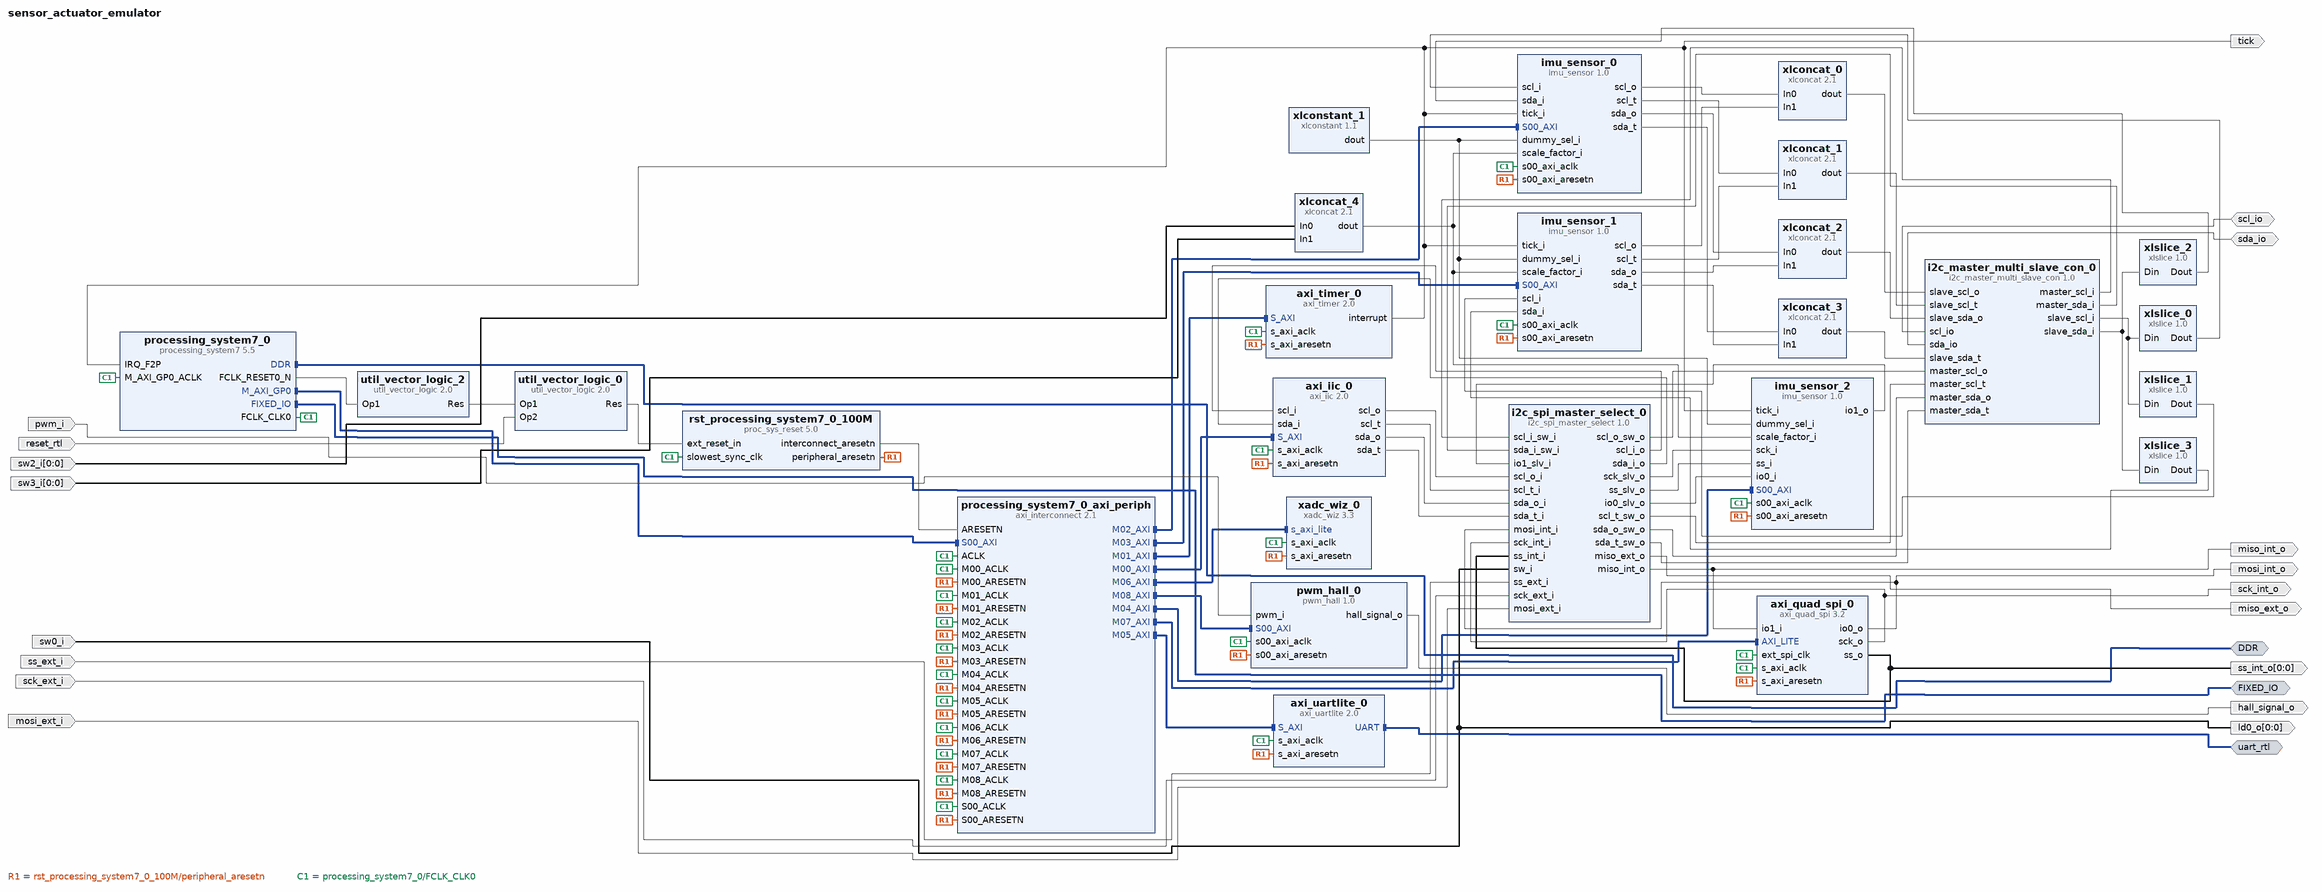
[diagram p0: block diagram of the top level]
# Vivado block design sensor_actuator_emulator, Vivado 2016.1
create_bd_design sensor_actuator_emulator

create_bd_intf_port -mode Master -vlnv xilinx.com:interface:uart_rtl:1.0 uart_rtl
create_bd_intf_port -mode Master -vlnv xilinx.com:interface:ddrx_rtl:1.0 DDR
create_bd_intf_port -mode Master -vlnv xilinx.com:display_processing_system7:fixedio_rtl:1.0 FIXED_IO
create_bd_port -dir IO scl_io
create_bd_port -dir IO sda_io
create_bd_port -dir O -type intr tick
create_bd_port -dir O hall_signal_o
create_bd_port -dir I pwm_i
create_bd_port -dir I -type rst reset_rtl
set_property -dict {CONFIG.POLARITY ACTIVE_HIGH} [get_bd_ports reset_rtl]
create_bd_port -dir O -from 0 -to 0 ld0_o
create_bd_port -dir I ss_ext_i
create_bd_port -dir I sck_ext_i
create_bd_port -dir I mosi_ext_i
create_bd_port -dir O miso_ext_o
create_bd_port -dir O miso_int_o
create_bd_port -dir O mosi_int_o
create_bd_port -dir O sck_int_o
create_bd_port -dir O -from 0 -to 0 ss_int_o
create_bd_port -dir I sw0_i
create_bd_port -dir I -from 0 -to 0 sw2_i
create_bd_port -dir I -from 0 -to 0 sw3_i

create_bd_cell -type ip -vlnv xilinx.com:ip:axi_iic:2.0 axi_iic_0
set_property -dict {CONFIG.IIC_FREQ_KHZ 400 CONFIG.USE_BOARD_FLOW true CONFIG.IIC_BOARD_INTERFACE Custom} [get_bd_cells axi_iic_0]
create_bd_cell -type ip -vlnv xilinx.com:ip:axi_uartlite:2.0 axi_uartlite_0
set_property -dict {CONFIG.C_BAUDRATE 115200} [get_bd_cells axi_uartlite_0]
create_bd_cell -type ip -vlnv xilinx.com:ip:xlconstant:1.1 xlconstant_1
set_property -dict {CONFIG.CONST_WIDTH 2} [get_bd_cells xlconstant_1]
create_bd_cell -type ip -vlnv user.org:user:i2c_master_multi_slave_con:1.0 i2c_master_multi_slave_con_0
set_property -dict {CONFIG.G_NUM_SLAVES 2} [get_bd_cells i2c_master_multi_slave_con_0]
create_bd_cell -type ip -vlnv xilinx.com:ip:xlconcat:2.1 xlconcat_0
set_property -dict {CONFIG.NUM_PORTS 2} [get_bd_cells xlconcat_0]
create_bd_cell -type ip -vlnv xilinx.com:ip:xlconcat:2.1 xlconcat_1
set_property -dict {CONFIG.NUM_PORTS 2} [get_bd_cells xlconcat_1]
create_bd_cell -type ip -vlnv xilinx.com:ip:xlconcat:2.1 xlconcat_2
set_property -dict {CONFIG.NUM_PORTS 2} [get_bd_cells xlconcat_2]
create_bd_cell -type ip -vlnv xilinx.com:ip:xlconcat:2.1 xlconcat_3
set_property -dict {CONFIG.NUM_PORTS 2} [get_bd_cells xlconcat_3]
create_bd_cell -type ip -vlnv xilinx.com:ip:xlslice:1.0 xlslice_0
set_property -dict {CONFIG.DIN_TO 0 CONFIG.DIN_FROM 0 CONFIG.DIN_WIDTH 2} [get_bd_cells xlslice_0]
create_bd_cell -type ip -vlnv xilinx.com:ip:xlslice:1.0 xlslice_1
set_property -dict {CONFIG.DOUT_WIDTH 1 CONFIG.DIN_TO 1 CONFIG.DIN_FROM 1 CONFIG.DIN_WIDTH 2} [get_bd_cells xlslice_1]
create_bd_cell -type ip -vlnv xilinx.com:ip:xlslice:1.0 xlslice_2
set_property -dict {CONFIG.DIN_TO 0 CONFIG.DIN_FROM 0 CONFIG.DIN_WIDTH 2} [get_bd_cells xlslice_2]
create_bd_cell -type ip -vlnv xilinx.com:ip:xlslice:1.0 xlslice_3
set_property -dict {CONFIG.DOUT_WIDTH 1 CONFIG.DIN_TO 1 CONFIG.DIN_FROM 1 CONFIG.DIN_WIDTH 2} [get_bd_cells xlslice_3]
create_bd_cell -type ip -vlnv xilinx.com:ip:xadc_wiz:3.3 xadc_wiz_0
set_property -dict [list \
  CONFIG.XADC_STARUP_SELECTION channel_sequencer \
  CONFIG.SEQUENCER_MODE Continuous \
  CONFIG.OT_ALARM false \
  CONFIG.USER_TEMP_ALARM false \
  CONFIG.VCCINT_ALARM false \
  CONFIG.VCCAUX_ALARM false \
  CONFIG.VCCINT_ALARM_LOWER 0.97 \
  CONFIG.VCCINT_ALARM_UPPER 1.03 \
  CONFIG.ENABLE_VCCPINT_ALARM false \
  CONFIG.ENABLE_VCCPAUX_ALARM false \
  CONFIG.ENABLE_VCCDDRO_ALARM false \
  CONFIG.SINGLE_CHANNEL_SELECTION VP_VN \
  CONFIG.ENABLE_EXTERNAL_MUX false \
  CONFIG.EXTERNAL_MUX_CHANNEL VP_VN \
  CONFIG.CHANNEL_ENABLE_TEMPERATURE true \
  CONFIG.CHANNEL_ENABLE_VCCINT true \
  CONFIG.CHANNEL_ENABLE_VP_VN false \
  CONFIG.ENABLE_TEMP_BUS false \
  CONFIG.ENABLE_AXI4STREAM false \
] [get_bd_cells xadc_wiz_0]
create_bd_cell -type ip -vlnv xilinx.com:ip:processing_system7:5.5 processing_system7_0
set_property -dict [list \
  CONFIG.PCW_UIPARAM_DDR_FREQ_MHZ 525 \
  CONFIG.PCW_CRYSTAL_PERIPHERAL_FREQMHZ 50.000000 \
  CONFIG.PCW_APU_PERIPHERAL_FREQMHZ 650 \
  CONFIG.PCW_SDIO_PERIPHERAL_FREQMHZ 50 \
  CONFIG.PCW_FPGA0_PERIPHERAL_FREQMHZ 100 \
  CONFIG.PCW_USE_FABRIC_INTERRUPT 1 \
  CONFIG.PCW_IRQ_F2P_INTR 1 \
  CONFIG.PCW_PRESET_BANK1_VOLTAGE {LVCMOS 1.8V} \
  CONFIG.PCW_UIPARAM_DDR_PARTNO {MT41K128M16 JT-125} \
  CONFIG.PCW_QSPI_PERIPHERAL_ENABLE 1 \
  CONFIG.PCW_QSPI_GRP_SINGLE_SS_ENABLE 1 \
  CONFIG.PCW_QSPI_GRP_FBCLK_ENABLE 1 \
  CONFIG.PCW_ENET0_PERIPHERAL_ENABLE 1 \
  CONFIG.PCW_ENET0_ENET0_IO {MIO 16 .. 27} \
  CONFIG.PCW_ENET0_GRP_MDIO_ENABLE 1 \
  CONFIG.PCW_ENET0_RESET_ENABLE 0 \
  CONFIG.PCW_SD0_PERIPHERAL_ENABLE 1 \
  CONFIG.PCW_SD0_GRP_CD_ENABLE 1 \
  CONFIG.PCW_SD0_GRP_CD_IO {MIO 47} \
  CONFIG.PCW_SD0_GRP_WP_ENABLE 1 \
  CONFIG.PCW_UART1_PERIPHERAL_ENABLE 1 \
  CONFIG.PCW_TTC0_PERIPHERAL_ENABLE 1 \
  CONFIG.PCW_USB0_PERIPHERAL_ENABLE 1 \
  CONFIG.PCW_USB0_RESET_ENABLE 1 \
  CONFIG.PCW_USB0_RESET_IO {MIO 46} \
  CONFIG.PCW_GPIO_MIO_GPIO_ENABLE 1 \
] [get_bd_cells processing_system7_0]
# 105 more settings of processing_system7_0 are not shown: defaults, MIO pin electricals, DDR timing, and values the tool derives
create_bd_cell -type ip -vlnv xilinx.com:ip:axi_interconnect:2.1 processing_system7_0_axi_periph
set_property -dict {CONFIG.NUM_MI 9} [get_bd_cells processing_system7_0_axi_periph]
create_bd_cell -type ip -vlnv xilinx.com:ip:proc_sys_reset:5.0 rst_processing_system7_0_100M
create_bd_cell -type ip -vlnv xilinx.com:ip:axi_quad_spi:3.2 axi_quad_spi_0
set_property -dict {CONFIG.C_USE_STARTUP 0 CONFIG.C_NUM_TRANSFER_BITS 16 CONFIG.Multiples16 6} [get_bd_cells axi_quad_spi_0]
create_bd_cell -type ip -vlnv xilinx.com:ip:axi_timer:2.0 axi_timer_0
set_property -dict {CONFIG.mode_64bit 0 CONFIG.enable_timer2 0} [get_bd_cells axi_timer_0]
create_bd_cell -type ip -vlnv xilinx.com:ip:util_vector_logic:2.0 util_vector_logic_0
set_property -dict {CONFIG.C_SIZE 1 CONFIG.C_OPERATION or} [get_bd_cells util_vector_logic_0]
create_bd_cell -type ip -vlnv xilinx.com:ip:util_vector_logic:2.0 util_vector_logic_2
set_property -dict {CONFIG.C_SIZE 1 CONFIG.C_OPERATION not} [get_bd_cells util_vector_logic_2]
create_bd_cell -type ip -vlnv user.org:user:i2c_spi_master_select:1.0 i2c_spi_master_select_0
create_bd_cell -type ip -vlnv xilinx.com:ip:xlconcat:2.1 xlconcat_4
create_bd_cell -type ip -vlnv user.org:user:imu_sensor:1.0 imu_sensor_0
create_bd_cell -type ip -vlnv user.org:user:imu_sensor:1.0 imu_sensor_1
set_property -dict {CONFIG.I2C_ADDRESS 0x68} [get_bd_cells imu_sensor_1]
create_bd_cell -type ip -vlnv user.org:user:imu_sensor:1.0 imu_sensor_2
set_property -dict {CONFIG.I2C_SPI_SELECT 1} [get_bd_cells imu_sensor_2]
create_bd_cell -type ip -vlnv user.org:user:pwm_hall:1.0 pwm_hall_0

# ---- connections ----

connect_bd_intf_net [get_bd_intf_pins processing_system7_0/M_AXI_GP0] [get_bd_intf_pins processing_system7_0_axi_periph/S00_AXI]
connect_bd_intf_net [get_bd_intf_pins processing_system7_0_axi_periph/M01_AXI] [get_bd_intf_pins axi_timer_0/S_AXI]
connect_bd_intf_net [get_bd_intf_pins processing_system7_0_axi_periph/M02_AXI] [get_bd_intf_pins imu_sensor_0/S00_AXI]
connect_bd_intf_net [get_bd_intf_pins processing_system7_0_axi_periph/M03_AXI] [get_bd_intf_pins imu_sensor_1/S00_AXI]
connect_bd_intf_net [get_bd_intf_pins processing_system7_0_axi_periph/M04_AXI] [get_bd_intf_pins imu_sensor_2/S00_AXI]
connect_bd_intf_net [get_bd_intf_pins processing_system7_0_axi_periph/M00_AXI] [get_bd_intf_pins axi_iic_0/S_AXI]
connect_bd_intf_net [get_bd_intf_pins processing_system7_0_axi_periph/M05_AXI] [get_bd_intf_pins axi_uartlite_0/S_AXI]
connect_bd_intf_net [get_bd_intf_pins processing_system7_0_axi_periph/M06_AXI] [get_bd_intf_pins xadc_wiz_0/s_axi_lite]
connect_bd_intf_net [get_bd_intf_pins processing_system7_0_axi_periph/M07_AXI] [get_bd_intf_pins axi_quad_spi_0/AXI_LITE]
connect_bd_intf_net [get_bd_intf_pins processing_system7_0_axi_periph/M08_AXI] [get_bd_intf_pins pwm_hall_0/S00_AXI]
connect_bd_intf_net [get_bd_intf_ports uart_rtl] [get_bd_intf_pins axi_uartlite_0/UART]
connect_bd_intf_net [get_bd_intf_ports DDR] [get_bd_intf_pins processing_system7_0/DDR]
connect_bd_intf_net [get_bd_intf_ports FIXED_IO] [get_bd_intf_pins processing_system7_0/FIXED_IO]
connect_bd_net [get_bd_ports scl_io] [get_bd_pins i2c_master_multi_slave_con_0/scl_io]
connect_bd_net [get_bd_ports sda_io] [get_bd_pins i2c_master_multi_slave_con_0/sda_io]
connect_bd_net [get_bd_pins xlconcat_0/dout] [get_bd_pins i2c_master_multi_slave_con_0/slave_scl_o]
connect_bd_net [get_bd_pins xlconcat_1/dout] [get_bd_pins i2c_master_multi_slave_con_0/slave_scl_t]
connect_bd_net [get_bd_pins xlconcat_2/dout] [get_bd_pins i2c_master_multi_slave_con_0/slave_sda_o]
connect_bd_net [get_bd_pins xlconcat_3/dout] [get_bd_pins i2c_master_multi_slave_con_0/slave_sda_t]
connect_bd_net [get_bd_pins i2c_master_multi_slave_con_0/slave_scl_i] [get_bd_pins xlslice_0/Din] [get_bd_pins xlslice_1/Din]
connect_bd_net [get_bd_pins i2c_master_multi_slave_con_0/slave_sda_i] [get_bd_pins xlslice_2/Din] [get_bd_pins xlslice_3/Din]
connect_bd_net [get_bd_pins rst_processing_system7_0_100M/peripheral_aresetn] \
  [get_bd_pins axi_timer_0/s_axi_aresetn] [get_bd_pins axi_iic_0/s_axi_aresetn] [get_bd_pins axi_uartlite_0/s_axi_aresetn] \
  [get_bd_pins xadc_wiz_0/s_axi_aresetn] [get_bd_pins axi_quad_spi_0/s_axi_aresetn] \
  [get_bd_pins imu_sensor_0/s00_axi_aresetn] [get_bd_pins imu_sensor_1/s00_axi_aresetn] \
  [get_bd_pins imu_sensor_2/s00_axi_aresetn] [get_bd_pins pwm_hall_0/s00_axi_aresetn] \
  [get_bd_pins processing_system7_0_axi_periph/S00_ARESETN] [get_bd_pins processing_system7_0_axi_periph/M00_ARESETN] \
  [get_bd_pins processing_system7_0_axi_periph/M01_ARESETN] [get_bd_pins processing_system7_0_axi_periph/M02_ARESETN] \
  [get_bd_pins processing_system7_0_axi_periph/M03_ARESETN] [get_bd_pins processing_system7_0_axi_periph/M04_ARESETN] \
  [get_bd_pins processing_system7_0_axi_periph/M05_ARESETN] [get_bd_pins processing_system7_0_axi_periph/M06_ARESETN] \
  [get_bd_pins processing_system7_0_axi_periph/M07_ARESETN] [get_bd_pins processing_system7_0_axi_periph/M08_ARESETN]
connect_bd_net [get_bd_pins rst_processing_system7_0_100M/interconnect_aresetn] [get_bd_pins processing_system7_0_axi_periph/ARESETN]
connect_bd_net [get_bd_pins xlconstant_1/dout] \
  [get_bd_pins imu_sensor_0/dummy_sel_i] [get_bd_pins imu_sensor_1/dummy_sel_i] [get_bd_pins imu_sensor_2/dummy_sel_i]
connect_bd_net -net xlconstant_0_dout [get_bd_pins xlconcat_4/dout] \
  [get_bd_pins imu_sensor_0/scale_factor_i] [get_bd_pins imu_sensor_1/scale_factor_i] \
  [get_bd_pins imu_sensor_2/scale_factor_i]
connect_bd_net [get_bd_pins imu_sensor_0/scl_o] [get_bd_pins xlconcat_0/In0]
connect_bd_net [get_bd_pins imu_sensor_1/scl_o] [get_bd_pins xlconcat_0/In1]
connect_bd_net [get_bd_pins imu_sensor_0/scl_t] [get_bd_pins xlconcat_1/In0]
connect_bd_net [get_bd_pins imu_sensor_1/scl_t] [get_bd_pins xlconcat_1/In1]
connect_bd_net [get_bd_pins imu_sensor_0/sda_o] [get_bd_pins xlconcat_2/In0]
connect_bd_net [get_bd_pins imu_sensor_1/sda_o] [get_bd_pins xlconcat_2/In1]
connect_bd_net [get_bd_pins imu_sensor_0/sda_t] [get_bd_pins xlconcat_3/In0]
connect_bd_net [get_bd_pins imu_sensor_1/sda_t] [get_bd_pins xlconcat_3/In1]
connect_bd_net [get_bd_pins xlslice_0/Dout] [get_bd_pins imu_sensor_0/scl_i]
connect_bd_net [get_bd_pins xlslice_1/Dout] [get_bd_pins imu_sensor_1/scl_i]
connect_bd_net [get_bd_pins xlslice_2/Dout] [get_bd_pins imu_sensor_0/sda_i]
connect_bd_net [get_bd_pins xlslice_3/Dout] [get_bd_pins imu_sensor_1/sda_i]
connect_bd_net [get_bd_pins axi_timer_0/interrupt] \
  [get_bd_ports tick] [get_bd_pins processing_system7_0/IRQ_F2P] [get_bd_pins imu_sensor_0/tick_i] \
  [get_bd_pins imu_sensor_1/tick_i] [get_bd_pins imu_sensor_2/tick_i]
connect_bd_net -net ACLK_1 [get_bd_pins processing_system7_0/FCLK_CLK0] \
  [get_bd_pins processing_system7_0/M_AXI_GP0_ACLK] [get_bd_pins axi_timer_0/s_axi_aclk] \
  [get_bd_pins rst_processing_system7_0_100M/slowest_sync_clk] [get_bd_pins axi_iic_0/s_axi_aclk] \
  [get_bd_pins axi_uartlite_0/s_axi_aclk] [get_bd_pins xadc_wiz_0/s_axi_aclk] [get_bd_pins axi_quad_spi_0/s_axi_aclk] \
  [get_bd_pins axi_quad_spi_0/ext_spi_clk] [get_bd_pins imu_sensor_0/s00_axi_aclk] [get_bd_pins imu_sensor_1/s00_axi_aclk] \
  [get_bd_pins imu_sensor_2/s00_axi_aclk] [get_bd_pins pwm_hall_0/s00_axi_aclk] \
  [get_bd_pins processing_system7_0_axi_periph/ACLK] [get_bd_pins processing_system7_0_axi_periph/S00_ACLK] \
  [get_bd_pins processing_system7_0_axi_periph/M00_ACLK] [get_bd_pins processing_system7_0_axi_periph/M01_ACLK] \
  [get_bd_pins processing_system7_0_axi_periph/M02_ACLK] [get_bd_pins processing_system7_0_axi_periph/M03_ACLK] \
  [get_bd_pins processing_system7_0_axi_periph/M04_ACLK] [get_bd_pins processing_system7_0_axi_periph/M05_ACLK] \
  [get_bd_pins processing_system7_0_axi_periph/M06_ACLK] [get_bd_pins processing_system7_0_axi_periph/M07_ACLK] \
  [get_bd_pins processing_system7_0_axi_periph/M08_ACLK]
connect_bd_net [get_bd_pins pwm_hall_0/hall_signal_o] [get_bd_ports hall_signal_o]
connect_bd_net [get_bd_ports pwm_i] [get_bd_pins pwm_hall_0/pwm_i]
connect_bd_net [get_bd_pins util_vector_logic_0/Res] [get_bd_pins rst_processing_system7_0_100M/ext_reset_in]
connect_bd_net [get_bd_pins util_vector_logic_2/Res] [get_bd_pins util_vector_logic_0/Op1]
connect_bd_net [get_bd_pins processing_system7_0/FCLK_RESET0_N] [get_bd_pins util_vector_logic_2/Op1]
connect_bd_net [get_bd_ports reset_rtl] [get_bd_pins util_vector_logic_0/Op2]
connect_bd_net -net sw_i_1 [get_bd_ports sw0_i] [get_bd_ports ld0_o] [get_bd_pins i2c_spi_master_select_0/sw_i]
connect_bd_net [get_bd_pins i2c_spi_master_select_0/sck_slv_o] [get_bd_pins imu_sensor_2/sck_i]
connect_bd_net [get_bd_pins i2c_spi_master_select_0/ss_slv_o] [get_bd_pins imu_sensor_2/ss_i]
connect_bd_net [get_bd_pins i2c_spi_master_select_0/io0_slv_o] [get_bd_pins imu_sensor_2/io0_i]
connect_bd_net [get_bd_pins imu_sensor_2/io1_o] [get_bd_pins i2c_spi_master_select_0/io1_slv_i]
connect_bd_net [get_bd_ports ss_ext_i] [get_bd_pins i2c_spi_master_select_0/ss_ext_i]
connect_bd_net [get_bd_ports sck_ext_i] [get_bd_pins i2c_spi_master_select_0/sck_ext_i]
connect_bd_net [get_bd_ports mosi_ext_i] [get_bd_pins i2c_spi_master_select_0/mosi_ext_i]
connect_bd_net [get_bd_pins i2c_spi_master_select_0/miso_ext_o] [get_bd_ports miso_ext_o]
connect_bd_net [get_bd_pins axi_iic_0/scl_o] [get_bd_pins i2c_spi_master_select_0/scl_o_i]
connect_bd_net [get_bd_pins i2c_spi_master_select_0/scl_o_sw_o] [get_bd_pins i2c_master_multi_slave_con_0/master_scl_o]
connect_bd_net [get_bd_pins i2c_spi_master_select_0/scl_i_o] [get_bd_pins axi_iic_0/scl_i]
connect_bd_net [get_bd_pins i2c_master_multi_slave_con_0/master_scl_i] [get_bd_pins i2c_spi_master_select_0/scl_i_sw_i]
connect_bd_net [get_bd_pins axi_iic_0/scl_t] [get_bd_pins i2c_spi_master_select_0/scl_t_i]
connect_bd_net [get_bd_pins i2c_spi_master_select_0/scl_t_sw_o] [get_bd_pins i2c_master_multi_slave_con_0/master_scl_t]
connect_bd_net [get_bd_pins i2c_spi_master_select_0/sda_i_o] [get_bd_pins axi_iic_0/sda_i]
connect_bd_net [get_bd_pins i2c_master_multi_slave_con_0/master_sda_i] [get_bd_pins i2c_spi_master_select_0/sda_i_sw_i]
connect_bd_net [get_bd_pins axi_iic_0/sda_o] [get_bd_pins i2c_spi_master_select_0/sda_o_i]
connect_bd_net [get_bd_pins i2c_spi_master_select_0/sda_o_sw_o] [get_bd_pins i2c_master_multi_slave_con_0/master_sda_o]
connect_bd_net [get_bd_pins axi_iic_0/sda_t] [get_bd_pins i2c_spi_master_select_0/sda_t_i]
connect_bd_net [get_bd_pins i2c_spi_master_select_0/sda_t_sw_o] [get_bd_pins i2c_master_multi_slave_con_0/master_sda_t]
connect_bd_net [get_bd_pins i2c_spi_master_select_0/miso_int_o] [get_bd_ports miso_int_o] [get_bd_pins axi_quad_spi_0/io1_i]
connect_bd_net [get_bd_pins axi_quad_spi_0/io0_o] [get_bd_ports mosi_int_o] [get_bd_pins i2c_spi_master_select_0/mosi_int_i]
connect_bd_net [get_bd_pins axi_quad_spi_0/sck_o] [get_bd_ports sck_int_o] [get_bd_pins i2c_spi_master_select_0/sck_int_i]
connect_bd_net [get_bd_pins axi_quad_spi_0/ss_o] [get_bd_ports ss_int_o] [get_bd_pins i2c_spi_master_select_0/ss_int_i]
connect_bd_net -net In0_1 [get_bd_ports sw2_i] [get_bd_pins xlconcat_4/In0]
connect_bd_net -net In1_1 [get_bd_ports sw3_i] [get_bd_pins xlconcat_4/In1]

# ---- address map ----
assign_bd_address -offset 0x41600000 -range 64K -target_address_space [get_bd_addr_spaces processing_system7_0/Data] [get_bd_addr_segs axi_iic_0/S_AXI/Reg]
assign_bd_address -offset 0x41E00000 -range 64K -target_address_space [get_bd_addr_spaces processing_system7_0/Data] [get_bd_addr_segs axi_quad_spi_0/AXI_LITE/Reg]
assign_bd_address -offset 0x42800000 -range 64K -target_address_space [get_bd_addr_spaces processing_system7_0/Data] [get_bd_addr_segs axi_timer_0/S_AXI/Reg]
assign_bd_address -offset 0x42C00000 -range 64K -target_address_space [get_bd_addr_spaces processing_system7_0/Data] [get_bd_addr_segs axi_uartlite_0/S_AXI/Reg]
assign_bd_address -offset 0x43C00000 -range 64K -target_address_space [get_bd_addr_spaces processing_system7_0/Data] [get_bd_addr_segs imu_sensor_0/S00_AXI/S00_AXI_reg]
assign_bd_address -offset 0x43C10000 -range 64K -target_address_space [get_bd_addr_spaces processing_system7_0/Data] [get_bd_addr_segs imu_sensor_1/S00_AXI/S00_AXI_reg]
assign_bd_address -offset 0x43C20000 -range 64K -target_address_space [get_bd_addr_spaces processing_system7_0/Data] [get_bd_addr_segs imu_sensor_2/S00_AXI/S00_AXI_reg]
assign_bd_address -offset 0x43C30000 -range 64K -target_address_space [get_bd_addr_spaces processing_system7_0/Data] [get_bd_addr_segs xadc_wiz_0/s_axi_lite/Reg]
assign_bd_address -offset 0x43C40000 -range 64K -target_address_space [get_bd_addr_spaces processing_system7_0/Data] [get_bd_addr_segs pwm_hall_0/S00_AXI/S00_AXI_reg]

validate_bd_design
save_bd_design
